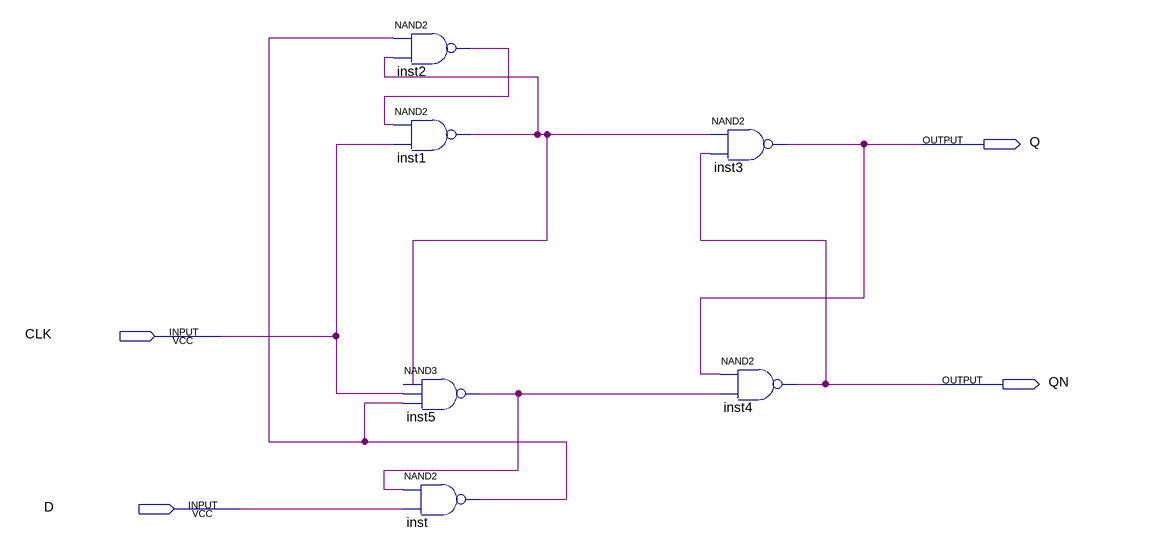
[diagram p0: schematic sheet]
// Quartus schematic lab9step3b.bdf as structural Verilog: 6 symbols, 4 pins
module lab9step3b (
  input  CLK,
  input  D,
  output Q,
  output QN
);

  wire inst1_out, inst2_out, inst5_out, inst_out;

  nand inst2 (inst2_out, inst_out, inst1_out);
  nand inst1 (inst1_out, inst2_out, CLK);
  nand inst5 (inst5_out, inst1_out, CLK, inst_out);
  nand inst (inst_out, inst5_out, D);
  nand inst3 (Q, inst1_out, QN);
  nand inst4 (QN, Q, inst5_out);
endmodule
